# EAGLE design working (EAGLE 9.6.2)
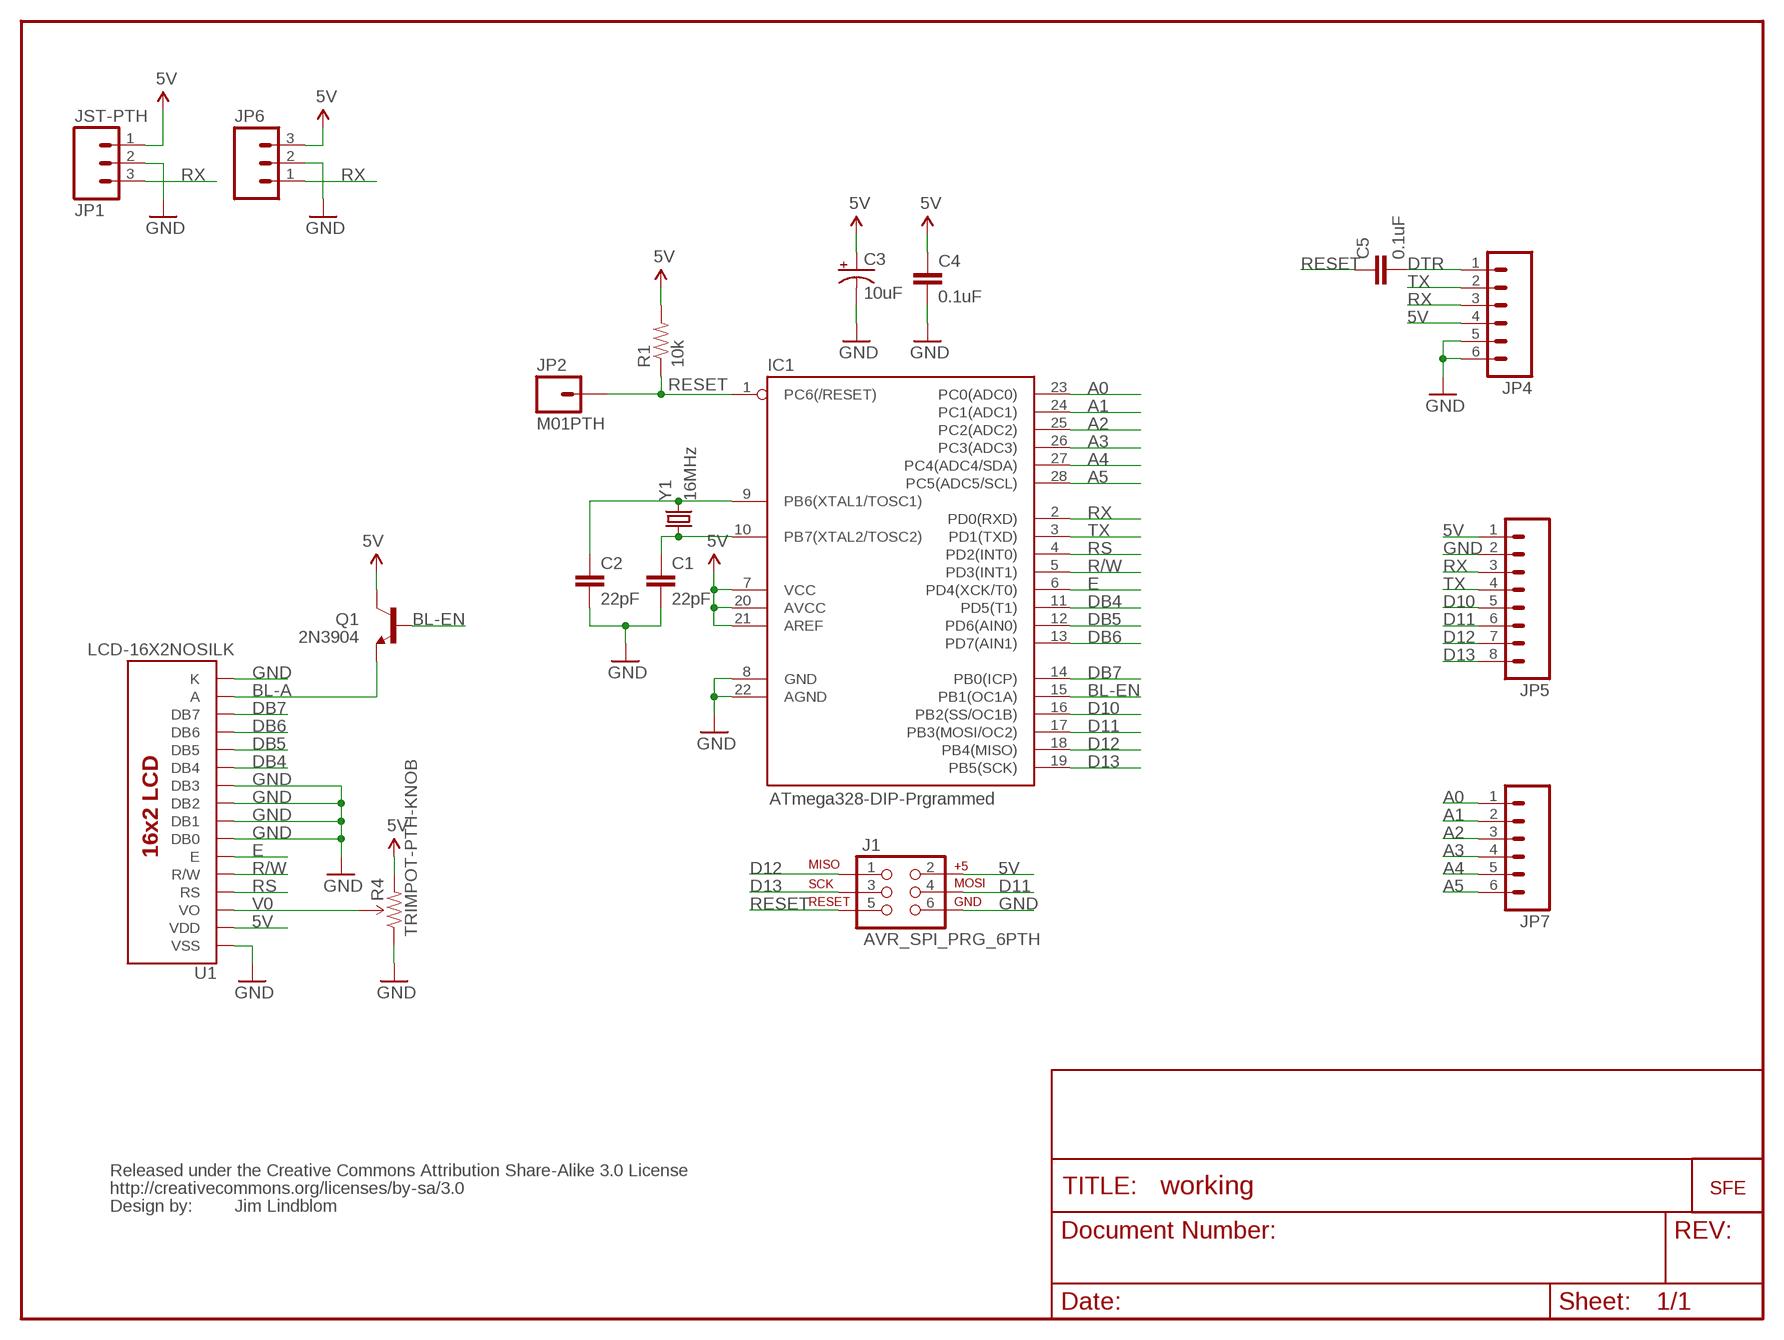
[diagram p0: schematic, sheet 1]

## Parts
C1  22pF  CAPPTH2  [CAP-PTH-SMALL2]
C2  22pF  CAPPTH2  [CAP-PTH-SMALL2]
C3  10uF  CAP_POLPTH2  [CPOL-RADIAL-10UF-25V]
C4  0.1uF  CAPPTH2  [CAP-PTH-SMALL2]
C5  0.1uF  CAPPTH2  [CAP-PTH-SMALL2]
IC1  ATmega328-DIP-Prgrammed  AVR-MEGA8-PPTH  [DIL28-3]
J1  AVR_SPI_PRG_6PTH  [2X3]
JP1  JST-PTH  M03JST-PTH  [JST-3-PTH]
JP2  M01PTH  [1X01]
JP3  LOGO-SFENEW  [SFE-NEW-WEBLOGO]
JP4  M06SIP  [1X06]
JP5  M08  [1X08]
JP6  M03PTH  [1X03]
JP7  M06SIP  [1X06]
Q1  2N3904  TRANSISTOR_NPNTO92  [TO-92]
R1  10k  RESISTORAXIAL-0.3  [AXIAL-0.3]
R4  TRIMPOT-PTH-KNOB  [3386U]
U1  LCD-16X2NOSILK  [LCD-16X2_NOSILK]
U$4  CREATIVE_COMMONS  [CREATIVE_COMMONS]
Y1  16MHz  CRYSTALHC49US  [HC49US]

## Nets
5V: C3.1(+) C4.1 IC1.7(VCC) IC1.20(AVCC) IC1.21(AREF) J1.2 JP1.1 JP4.4 JP5.1 JP6.3 Q1.3(C) R1.P$2 R4.3(CW) U1.2(VDD)
A0: IC1.23(PC0(ADC0)) JP7.1
A1: IC1.24(PC1(ADC1)) JP7.2
A2: IC1.25(PC2(ADC2)) JP7.3
A3: IC1.26(PC3(ADC3)) JP7.4
A4: IC1.27(PC4(ADC4/SDA)) JP7.5
A5: IC1.28(PC5(ADC5/SCL)) JP7.6
BL-A: Q1.1(E) U1.15(A)
BL-EN: IC1.15(PB1(OC1A)) Q1.2(B)
D10: IC1.16(PB2(SS/OC1B)) JP5.5
D11: IC1.17(PB3(MOSI/OC2)) J1.4 JP5.6
D12: IC1.18(PB4(MISO)) J1.1 JP5.7
D13: IC1.19(PB5(SCK)) J1.3 JP5.8
DB4: IC1.11(PD5(T1)) U1.11(DB4)
DB5: IC1.12(PD6(AIN0)) U1.12(DB5)
DB6: IC1.13(PD7(AIN1)) U1.13(DB6)
DB7: IC1.14(PB0(ICP)) U1.14(DB7)
DTR: C5.2 JP4.1
E: IC1.6(PD4(XCK/T0)) U1.6(E)
GND: C1.2 C2.2 C3.2(-) C4.2 IC1.8(GND) IC1.22(AGND) J1.6 JP1.2 JP4.5 JP4.6 JP5.2 JP6.2 R4.1(CCW) U1.1(VSS) U1.7(DB0) U1.8(DB1) U1.9(DB2) U1.10(DB3) U1.16(K)
R/W: IC1.5(PD3(INT1)) U1.5(R/W)
RESET: C5.1 IC1.1(PC6(/RESET)) J1.5 JP2.1 R1.P$1
RS: IC1.4(PD2(INT0)) U1.4(RS)
RX: IC1.2(PD0(RXD)) JP1.3 JP4.3 JP5.3 JP6.1
TX: IC1.3(PD1(TXD)) JP4.2 JP5.4
V0: R4.2(WIPER) U1.3(VO)
XTAL1: C2.1 IC1.9(PB6(XTAL1/TOSC1)) Y1.2
XTAL2: C1.1 IC1.10(PB7(XTAL2/TOSC2)) Y1.1

## Notes on the sheet
- Jim Lindblom

## Library data of the parts
C1 C2 C4 C5 = SparkFun:CAP: Capacitor Standard 0603 ceramic capacitor, and 0.1" leaded capacitor.
C3 = SparkFun:CAP_POL: Capacitor Polarized These are standard SMD and PTH capacitors. Normally 10uF, 47uF, and 100uF in electrolytic and tantalum varieties. Always verify the external diameter of the through hole cap, it varies with capacity, voltage, and manufacturer. The EIA devices should be standard.
IC1 = SparkFun:AVR-MEGA8-P: MICROCONTROLLER 8 Kbytes FLASH 1 kbytes SRAM 512 bytes EEPROM USART 4-channel 10 bit ADC 2-channel 8 bit ADC
J1 = SparkFun:AVR_SPI_PRG_6: AVR ISP 6 Pin This is the reduced ISP connector for AVR programming. Common on Arduino. This footprint will take up less PCB space and can be used with a 10-pin to 6-pin adapter such as SKU: BOB-08508
JP1 JP6 = SparkFun:M03: Header 3 Standard 3-pin 0.1" header. Use with straight break away headers (SKU : PRT-00116), right angle break away headers (PRT-00553), swiss pins (PRT-00743), machine pins (PRT-00117), and female headers (PRT-00115). Molex polarized connector foot print use with SKU : PRT-08232 with associated crimp pins and housings.
JP2 = SparkFun:M01: Header 1 Standard 1-pin 0.1" header. Use with straight break away headers (SKU : PRT-00116), right angle break away headers (PRT-00553), swiss pins (PRT-00743), machine pins (PRT-00117), and female headers (PRT-00115).
JP3 = SparkFun:LOGO-SFE: Spark Fun Electronics PCB Logo This is the standard Spark Fun Electronics PCB logo.
JP4 JP7 = SparkFun:M06: Header 6 Standard 6-pin 0.1" header. Use with straight break away headers (SKU : PRT-00116), right angle break away headers (PRT-00553), swiss pins (PRT-00743), machine pins (PRT-00117), and female headers (PRT-00115). Molex polarized connector foot print use with SKU : PRT-08094 with associated crimp pins and housings. NOTES ON THE VARIANTS LOCK and LOCK_LONGPADS... This footprint was designed to help hold the alignment of a through-hole component (i.e. 6-pin header) while soldering it into place. You may notice that each hole has been shifted either up or down by 0.005 of an inch from it's more standard position (which is a perfectly straight line). This slight alteration caused the pins (the squares in the middle) to touch the edges of the holes. Because they are alternating, it causes a "brace" to hold the component in place. 0.005 has proven to be the perfect amount of "off-center" position when using our standard breakaway headers. Although looks a little odd when you look at the bare footprint, once you have a header in there, the alteration is very hard to notice. Also, if you push a header all the way into place, it is covered up entirely on the bottom side. This idea of altering the position of holes to aid alignment will be further integrated into the Sparkfun Library for other footprints. It can help hold any component with 3 or more connection pins.
JP5 = SparkFun:M08: Header 8 Standard 8-pin 0.1" header. Use with straight break away headers (SKU : PRT-00116), right angle break away headers (PRT-00553), swiss pins (PRT-00743), machine pins (PRT-00117), and female headers (PRT-00115).
Q1 = SparkFun:TRANSISTOR_NPN: Transistor NPN BJT configuration in SOT23 package. MMBT2222 is the common NPN we use. Double check BCE configuration again layout.
R1 = SparkFun:RESISTOR: Resistor Basic schematic elements and footprints for 0603, 1206, and PTH resistors.
R4 = SparkFun:TRIMPOT
U1 = SparkFun-Displays:LCD-16X2: Standard text-only 16x2 parallel input LCD Basic 16 character by 2 line display. Typically utilizes the extremely common HD44780 parallel interface chipset SparkFun Products: Basic 16x2 Green <https://www.sparkfun.com/products/255> Basic 8x2 Green <https://www.sparkfun.com/products/11122>; SF_ID: LCD-00255
U$4 = SparkFun:CREATIVE_COMMONS
Y1 = SparkFun:CRYSTAL: Crystals Various standard crystals. Proven footprints. Spark Fun Electronics SKU : COM-00534

## Board
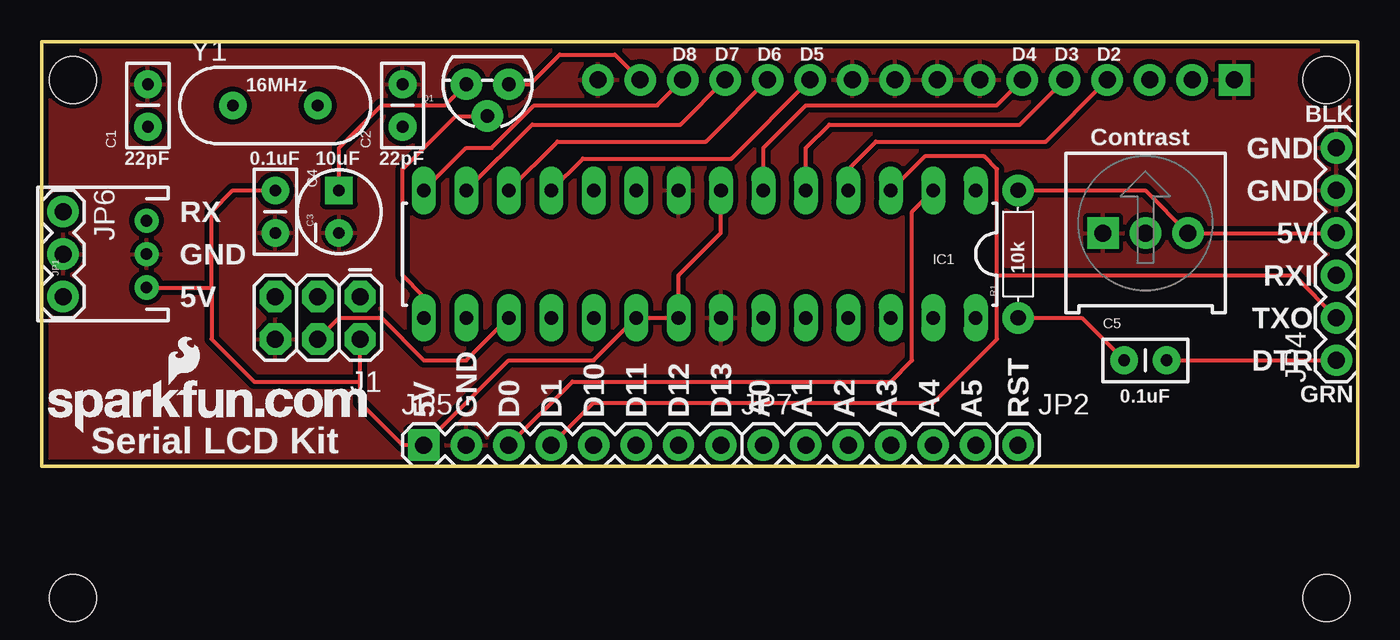
[diagram p1: board, top side]
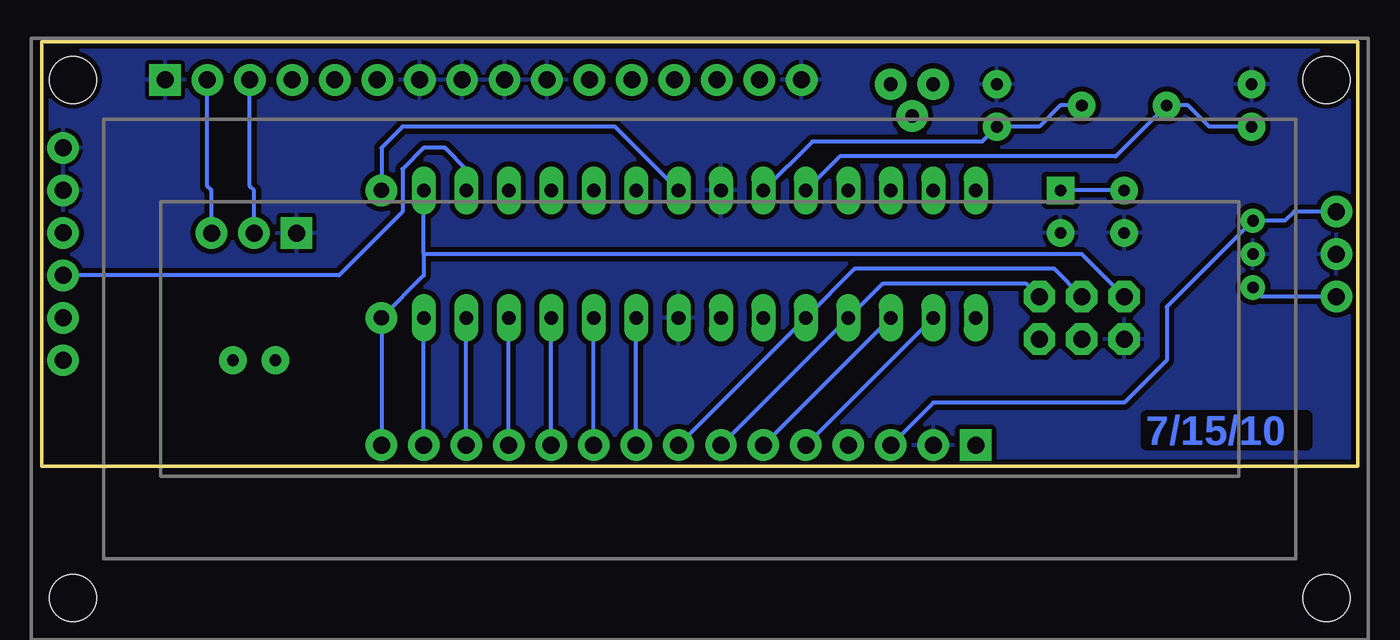
[diagram p2: board, bottom side, seen from below]

Size 78.74 x 25.4 mm. Coordinates in mm from the lower left corner, seen from the top.
Outline: 78.74,0 78.74,25.4 0,25.4 0,0 78.74,0
Copper layers (1*16): Top 0.035mm / dielectric 1.5mm / Bottom 0.035mm
Design rules "SparkFun": minimum track width 8mil, minimum drill 20mil, track to track 8mil, track to pad 8mil, pad to pad 8mil, via to via 8mil, smd to smd 8mil, copper to edge 8mil, drill to drill 8mil, minimum pad ring 12mil, minimum via ring 10mil, stop-mask expansion 4mil, vias tented up to drill 20mil, thermal gap 10mil

### Footprints (pad centres in the part's own frame; a part is rotated, then mirrored left to right if it is on the bottom)
CAP-PTH-SMALL2 = drill 0.7 pad 1.651: 1 0,0; 2 2.54,0
CPOL-RADIAL-10UF-25V = drill 0.7 pad 1.651 square: 1 1.27,0 | drill 0.7 pad 1.651: 2 -1.27,0
DIL28-3 = drill 0.813 long: 1 -16.51,-3.81; 2 -13.97,-3.81; 3 -11.43,-3.81; 4 -8.89,-3.81; 5 -6.35,-3.81; 6 -3.81,-3.81; 7 -1.27,-3.81; 8 1.27,-3.81; 9 3.81,-3.81; 10 6.35,-3.81; 11 8.89,-3.81; 12 11.43,-3.81; 13 13.97,-3.81; 14 16.51,-3.81; 15 16.51,3.81; 16 13.97,3.81; 17 11.43,3.81; 18 8.89,3.81; 19 6.35,3.81; 20 3.81,3.81; 21 1.27,3.81; 22 -1.27,3.81; 23 -3.81,3.81; 24 -6.35,3.81; 25 -8.89,3.81; 26 -11.43,3.81; 27 -13.97,3.81; 28 -16.51,3.81
2X3 = drill 1.016 pad 1.88 octagon: 1 0,0; 2 0,2.54; 3 2.54,0; 4 2.54,2.54; 5 5.08,0; 6 5.08,2.54
JST-3-PTH = drill 0.7 pad 1.448: 1 -2,-5; 2 0,-5; 3 2,-5
1X01 = drill 1.016 pad 1.88: 1 0,0
1X06 = drill 1.016 pad 1.88: 1 0,0; 2 2.54,0; 3 5.08,0; 4 7.62,0; 5 10.16,0; 6 12.7,0
1X08 = drill 1.016 pad 1.88 square: 1 0,0 | drill 1.016 pad 1.88: 2 2.54,0; 3 5.08,0; 4 7.62,0; 5 10.16,0; 6 12.7,0; 7 15.24,0; 8 17.78,0
1X03 = drill 1.016 pad 1.88: 1 0,0; 2 2.54,0; 3 5.08,0
TO-92 = drill 0.813 pad 1.88: 1 -1.27,0; 2 0,1.905; 3 1.27,0
AXIAL-0.3 = drill 0.9 pad 1.88: P$1 -3.81,0; P$2 3.81,0
3386U = drill 1.016 pad 1.88 square: 1 -2.54,-0.015 | drill 1.016 pad 1.88: 2 0,-0.015; 3 2.54,-0.015
LCD-16X2_NOSILK = drill 1.016 pad 1.88 square: 1 -32,15.5 | drill 1.016 pad 1.88: 2 -29.46,15.5; 3 -26.92,15.5; 4 -24.38,15.5; 5 -21.84,15.5; 6 -19.3,15.5; 7 -16.76,15.5; 8 -14.22,15.5; 9 -11.68,15.5; 10 -9.14,15.5; 11 -6.6,15.5; 12 -4.06,15.5; 13 -1.52,15.5; 14 1.02,15.5; 15 3.56,15.5; 16 6.1,15.5 | hole 2.8: -37.5,15.5; -37.5,-15.5; 37.5,15.5; 37.5,-15.5
HC49US = drill 0.7 pad 1.651: 1 -2.54,0; 2 2.54,0

### Placement (x,y rotation side)
C1  6.35,20.32 90 top
C2  21.59,20.32 90 top
C3  17.78,15.24 90 top
C4  13.97,16.51 270 top
C5  64.77,6.35 0 top
IC1  39.37,12.7 180 top
J1  19.05,10.16 180 top
JP1  1.27,12.7 90 top
JP2  58.42,1.27 0 top
JP3  0.38,2.03 0 top
JP4  77.47,6.35 90 top
JP5  22.86,1.27 0 top
JP6  1.27,15.24 270 top
JP7  43.18,1.27 0 top
Q1  26.67,22.86 180 top
R1  58.42,12.7 90 top
R4  66.04,13.97 0 top
U1  39.37,7.62 0 bottom
U$4  20.32,-10.16 0 top  (outside the outline)
Y1  13.97,21.59 0 top

### Tracks (layer width: path | path; a pad name or v marks a point on that pad's centre or on a via)
5V
  Top 0.254: Q1.3 24.13,21.59 20.32,21.59 17.78,19.05 C3.1 | IC1.7 40.64,13.97 38.1,11.43 IC1.21 IC1.20 33.02,6.35 27.94,6.35 JP5.1 21.59,1.27 19.05,3.81 19.05,5.08 | R1.P$2 66.03,16.51 R4.3 77.45,13.96 JP4.4 | C4.1 11.43,16.51 10.16,15.24 10.16,10.67 | 10.16,10.67 10.16,7.62 12.7,5.08 19.05,5.08 | JP1.1 10.13,10.7 10.16,10.67 | 19.05,5.08 J1.2
  Bottom 0.254: JP6.3 5.73,10.16 JP1.1 | C4.1 C3.1 | IC1.7 44.45,20.32 57.15,20.32 58.42,19.05 R1.P$2 | U1.2 68.83,16.76 68.58,16.51 R4.3
A0
  Bottom 0.254: JP7.1 IC1.23
A1
  Bottom 0.254: JP7.2 IC1.24
A2
  Bottom 0.254: JP7.3 IC1.25
A3
  Bottom 0.254: JP7.4 IC1.26
A4
  Bottom 0.254: JP7.5 IC1.27
A5
  Bottom 0.254: JP7.6 IC1.28
BL-A
  Top 0.254: Q1.1 29.21,22.86 30.99,24.64 34.29,24.64 U1.15
BL-EN
  Top 0.254: Q1.2 24.77,20.95 21.59,17.78 21.59,11.43 22.86,10.16 IC1.15
D10
  Bottom 0.254: JP5.5 IC1.16
D11
  Top 0.254: J1.4 17.78,8.89 20.32,8.89 22.86,6.35 25.4,6.35 IC1.17
  Bottom 0.254: IC1.17 JP5.6
D12
  Bottom 0.254: JP5.7 IC1.18 28.45,10.92 19.81,10.92 J1.1
D13
  Bottom 0.254: JP5.8 IC1.19 30.1,11.81 18.16,11.81 J1.3
DB4
  Top 0.254: U1.11 41.27,18.41 32.38,18.41 IC1.11
DB5
  Top 0.254: U1.12 39.74,19.43 30.86,19.43 IC1.12
DB6
  Top 0.254: U1.13 38.22,20.45 29.34,20.45 IC1.13
DB7
  Top 0.254: IC1.14 25.4,19.05 26.92,19.05 29.46,21.59 36.82,21.59 U1.14
DTR
  Top 0.254: C5.2 JP4.1
E
  Top 0.254: U1.6 57.14,21.59 45.72,21.59 43.18,19.05 IC1.6
GND
  pour Bottom (isolate 0.305): 0,25.4 0,0 78.74,0 78.74,25.4
  pour Top (isolate 0.305): 0,25.4 0,0 78.74,0 78.74,25.4
R/W
  Top 0.254: IC1.5 45.72,19.05 47.12,20.45 58.54,20.45 U1.5
RESET
  Top 0.254: R1.P$1 62.23,8.89 C5.1
  Bottom 0.254: J1.5 16.51,12.7 55.88,12.7 | JP2.1 R1.P$1 55.88,11.43 55.88,12.7 | 55.88,12.7 IC1.1
RS
  Top 0.254: IC1.4 48.26,17.78 49.91,19.43 60.07,19.43 63.5,22.86 63.5,22.87 U1.4
RX
  Top 0.254: IC1.2 52.07,15.24 52.07,6.35 50.8,5.08 31.75,5.08 JP5.3
  Bottom 0.254: IC1.2 53.34,17.78 54.61,19.05 55.88,19.05 57.15,17.78 57.15,15.24 60.96,11.43 JP4.3 | JP6.1 3.81,15.24 4.35,14.7 JP1.3 11.43,9.54 11.43,6.35 13.97,3.81 25.4,3.81 JP5.3
TX
  Top 0.254: JP5.4 33.02,3.81 53.34,3.81 57.15,7.62 57.15,11.43 | 57.15,11.43 57.15,17.78 56.39,18.54 52.83,18.54 IC1.3 | JP4.2 74.93,11.43 57.15,11.43
V0
  Bottom 0.254: R4.2 66.04,16.51 66.29,16.76 U1.3
XTAL1
  Bottom 0.254: Y1.2 17.78,21.59 19.05,20.32 C2.1 22.48,19.43 32.64,19.43 IC1.9
XTAL2
  Bottom 0.254: C1.1 8.89,20.32 10.16,21.59 Y1.1 14.48,18.54 30.99,18.54 IC1.10

### Text on the board
Bottom: 7/15/10
tPlace: D8 | D7 | D6 | D5 | D4 | D3 | D2 | 16MHz | BLK | GND | Contrast | 22pF | 0.1uF | 10uF | 22pF | GND | RX | 5V | GND | RXI | 5V | TXO | DTR | GRN | 0.1uF | 5V | GND | D0 | D1 | D10 | D11 | D12 | D13 | A0 | A1 | A2 | A3 | A4 | A5 | RST | Serial LCD Kit